# Altium schematic sheet Input_Gain.SchDoc: Wprowadź Tytuł
size A4; CheckedBy: Wprowadź sprawdzającego; CompanyName: Politechnika Warszawska; DrawnBy: Wprowadź autora; Organization: Koło Naukowe Robotyków; Address1: Nowowiejska 24; Address2: 00-001; Address3: Warszawa; Address4: Polska; Revision: V*.*; DrawnDate: 10.10.20; CheckDate: 10.10.20; ProjectName: Nazwa Projektu
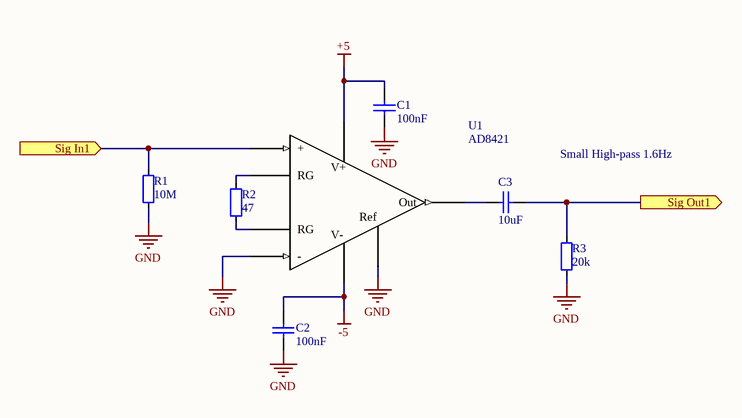
[diagram p0: Input_Gain.SchDoc]

## Parts
C1  value 100nF  [CAPC0603M]  (hidden comment: Cap)
C2  value 100nF  [CAPC0603M]  (hidden comment: Cap)
C3  value 10uF  [CAPC0603M]  (hidden comment: Cap)
R1  10M  [RESC0603]
R2  47  [RESC0603]
R3  20k  [RESC0603]
U1  AD8421  [SOIC127P600X175-8N]

## Ports
Sig In1 (in), Sig Out1 (out)

## Nets
+5: C1.2 U1.8(V+)
-5: C2.1 U1.5(V-)
GND: C1.1 C2.2 R1.1 R3.1 U1.1(-) U1.6(Ref)
Sig In1: R1.2 U1.4(+) ; port Sig In1
Sig Out1: C3.2 R3.2 ; port Sig Out1
NetC3_1: C3.1 U1.7(Out)
NetR2_1: R2.1 U1.3(RG)
NetR2_2: R2.2 U1.2(RG)

## Notes on the sheet
- Small High-pass 1.6Hz
- Project
- Rev.
- Title
- Drawn by
- Date
- Sheet
- of
- Checked by

## Library data of the parts
C1-C3 = Cap: Ceramic capacitor; Unit Price1: *; Unit Price2: *
R1-R3 = RES: Resistior
  R1: Value: 10M
  R2: Value: 47
  R3: Value: 20k
U1 = AD8421: 10MHz    +-2.5-18V  Instrumentation Amplifier; ComponentLink1Description: datasheet; ComponentLink1URL: https://www.tme.eu/Document/c72dc595607ee32045c3f9fad3f223f3/AD8421.pdf; ComponentLink2Description: TME; ComponentLink2URL: https://www.tme.eu/pl/details/ad8421arz/wzmacniacze-operacyjne-smd/analog-devices/